# Altium schematic sheet 08 Motion.SchDoc
size A
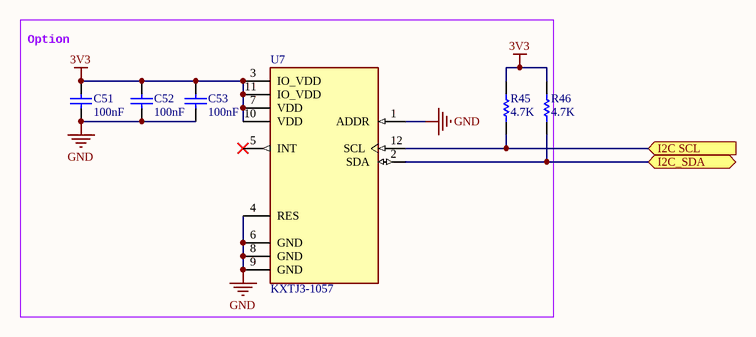
[diagram p0: 08 Motion.SchDoc]

## Parts
C51  100nF  [0603 - C]
C52  100nF  [0603 - C]
C53  100nF  [0603 - C]
R45  4.7K  [0603 - R]
R46  4.7K  [0603 - R]
U7  KXTJ3-1057  [KXTJ3-1057]

## Blocks framed on the sheet
Option: C51-C53 R45 R46 U7

## Ports
I2C SCL (in), I2C_SDA (bidir)

## Nets
3V3: C51.2 C52.2 C53.2 R45.2 R46.2 U7.3(IO_VDD) U7.7(VDD) U7.10(VDD) U7.11(IO_VDD)
GND: C51.1 C52.1 C53.1 U7.1(ADDR) U7.4(RES) U7.6(GND) U7.8(GND) U7.9(GND)
I2C SCL: R45.1 U7.12(SCL) ; port I2C SCL
I2C_SDA: R46.1 U7.2(SDA) ; port I2C_SDA

Not connected (* = marked no-connect by the designer): U7 5(INT)*

## Library data of the parts
C51-C53 = Cap 0603 100nF: CAP CER 100nF 50V C0G/NP0 0603 ±5%; MPN: CL10C104JB8NNNC; MFR: SAMSUNG; Company ID: VT_CAP_C0603 100nF; Voltage: 50V; Package: 0603; Size: C0603: 100nF; Value: 100nF
R45 R46 = Res 0603 4.7K: RES SMD 4.7K OHM 1% 1/10W 0603; MFR: Yageo; MPN: RC0603FR-074K7L; Company ID: VT_RES_R0603 4.7K; Size: R0603: 4.7K; Value: 4.7K
U7 = KXTJ3-1057: ACCELEROMETER 2-16G I2C 12LGA; MFR: Kionix Inc.; Company ID: VT_IC_KXTJ3-1057; MPN: KXTJ3-1057